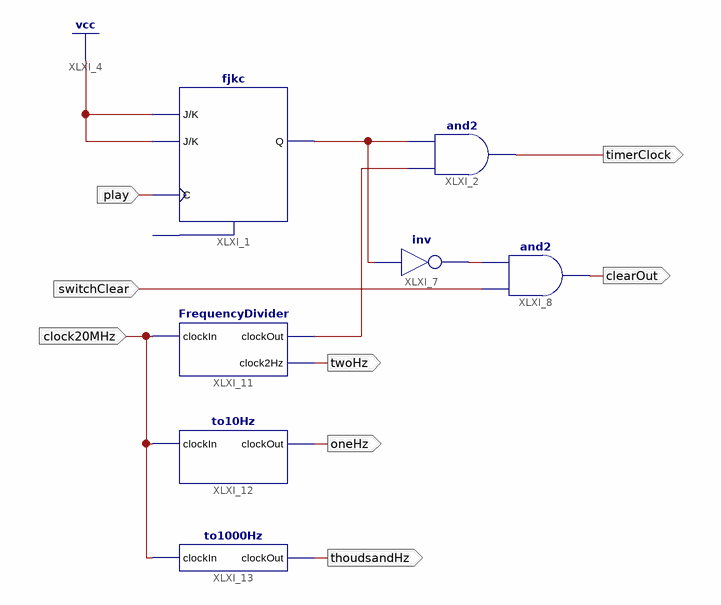
[diagram p0: schematic sheet 1]
// Xilinx ISE schematic switch.sch (spartan6) as structural Verilog: 7 symbols, 8 ports
module switch (
  input  clock20MHz,
  input  play,
  input  switchClear,
  output timerClock,
  output clearOut,
  output twoHz,
  output oneHz,
  output thoudsandHz
);

  wire XLXN_5, XLXN_11, XLXN_15;

  fjkc XLXI_1 (.C(play), .J(1'b1), .K(1'b1), .Q(XLXN_11));  // open: CLR
  and XLXI_2 (timerClock, XLXN_5, XLXN_11);
  not XLXI_7 (XLXN_15, XLXN_11);
  and XLXI_8 (clearOut, switchClear, XLXN_15);
  FrequencyDivider XLXI_11 (.clockIn(clock20MHz), .clockOut(XLXN_5), .clock2Hz(twoHz));
  to10Hz XLXI_12 (.clockIn(clock20MHz), .clockOut(oneHz));
  to1000Hz XLXI_13 (.clockIn(clock20MHz), .clockOut(thoudsandHz));
endmodule
